# Altium schematic sheet Circuit de priorité.SchDoc
size A4; SheetNumber: 3; SheetTotal: 7
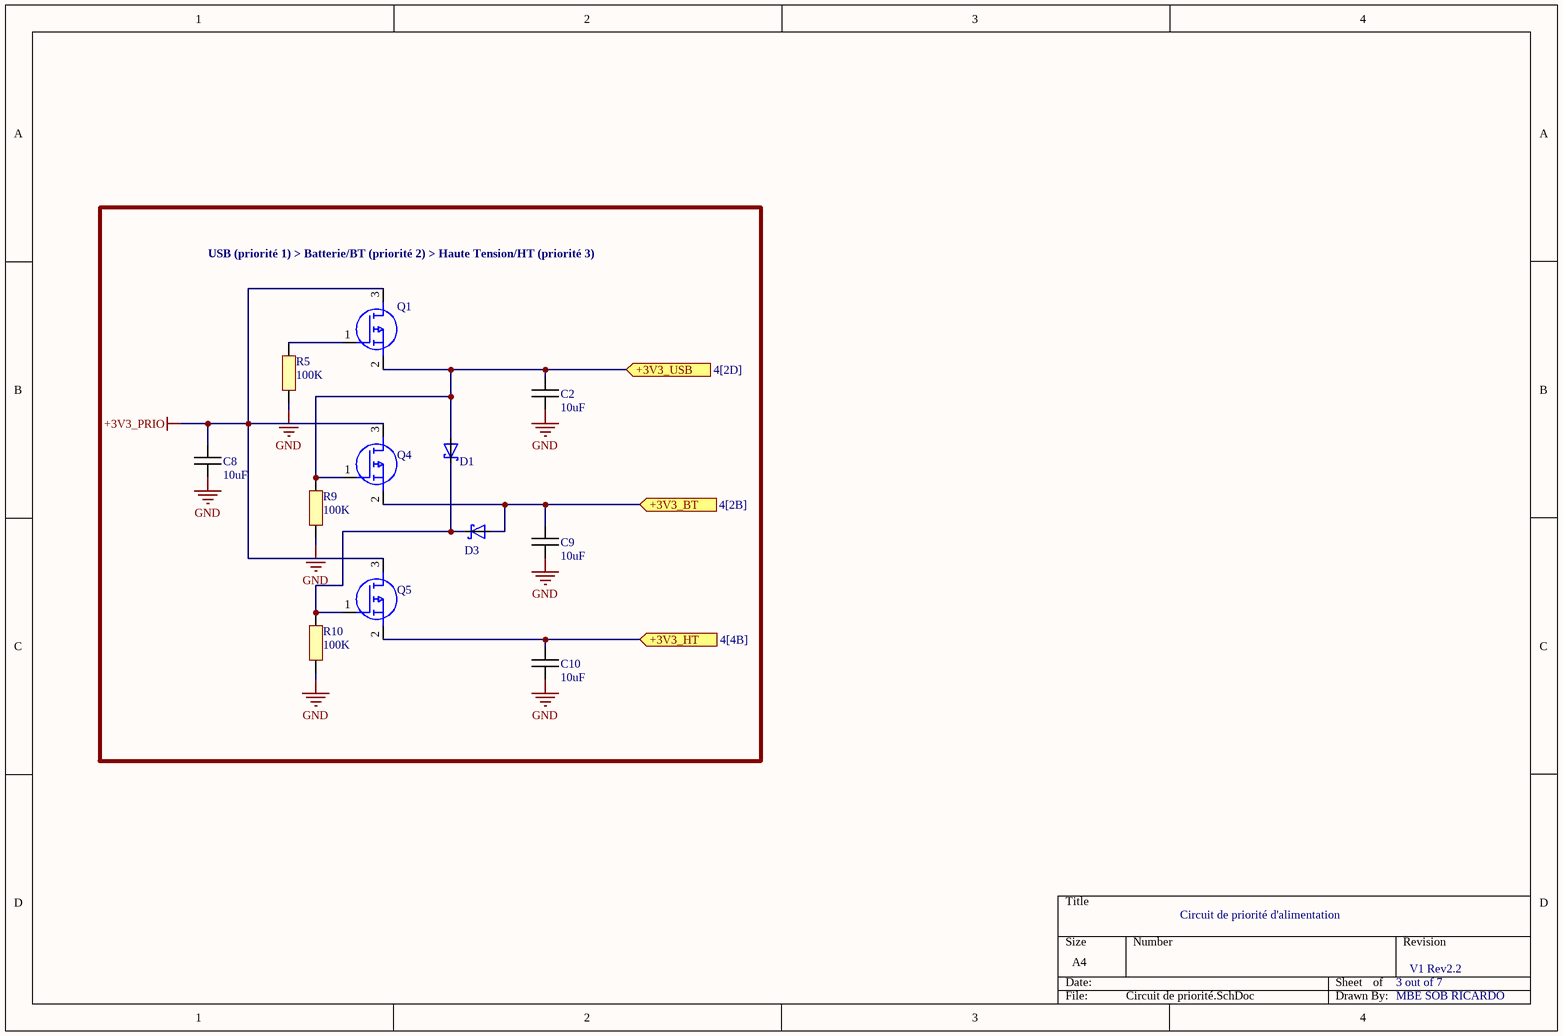
[diagram p0: Circuit de priorité.SchDoc]

## Parts
C2  10uF  [CAPC1005X06N]
C8  10uF  [CAPC1005X06N]
C9  10uF  [CAPC1005X06N]
C10  10uF  [CAPC1005X06N]
D1  SD103AWS-7-F  [SD103AWS-7-F]  (value not drawn)
D3  SD103AWS-7-F  [SD103AWS-7-F]  (value not drawn)
Q1  SI3139K-TP  [SI3139K-TP]  (value not drawn)
Q4  SI3139K-TP  [SI3139K-TP]  (value not drawn)
Q5  SI3139K-TP  [SI3139K-TP]  (value not drawn)
R5  100K  [RESC1005X06N]
R9  100K  [RESC1005X06N]
R10  100K  [RESC1005X06N]

## Ports
+3V3_BT (in, see 4[2B]), +3V3_HT (in, see 4[4B]), +3V3_USB (in, see 4[2D])

## Nets
+3V3_PRIO: C8.1 Q1.3(D) Q4.3(D) Q5.3(D)
GND: C2.2 C8.2 C9.2 C10.2 R5.2 R9.2 R10.2
+3V3_BT: C9.1 D3.2(A) Q4.2(S) ; port +3V3_BT
+3V3_HT: C10.1 Q5.2(S) ; port +3V3_HT
+3V3_USB: C2.1 D1.2(A) Q1.2(S) Q4.1(G) R9.1 ; port +3V3_USB
NetD1_1: D1.1(C) D3.1(C) Q5.1(G) R10.1
NetQ1_1: Q1.1(G) R5.1

## Notes on the sheet
- (near Q1) USB (priorité 1) > Batterie/BT (priorité 2) > Haute Tension/HT (priorité 3)
- Circuit de priorité d'alimentation
- 3 out of 7
- V1 Rev2.2
- MBE SOB RICARDO

## Library data of the parts
C2 C8-C10 = Capacitor
D1 D3 = SD103AWS-7-F: Diode Array 3 Independent Schottky 40V 175mA Surface Mount 6-TSSOP, SC-88, SOT-363
Q1 Q4 Q5 = SI3139K-TP: MOSFET P-Channel MOSFET
R5 R9 R10 = Resistor